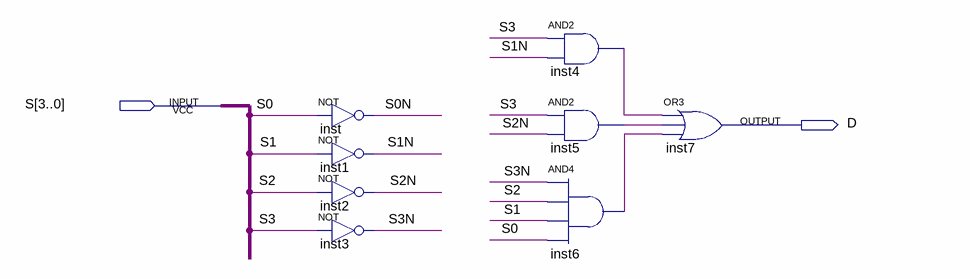
[diagram p0: schematic sheet]
// Quartus schematic D3.bdf as structural Verilog: 8 symbols, 2 pins
module D3 (
  input  [3:0] S,
  output D
);

  wire inst4_out, inst5_out, inst6_out, S0N, S1N, S2N, S3N;

  not inst (S0N, S[0]);
  not inst1 (S1N, S[1]);
  not inst2 (S2N, S[2]);
  not inst3 (S3N, S[3]);
  and inst4 (inst4_out, S[3], S1N);
  and inst5 (inst5_out, S[3], S2N);
  and inst6 (inst6_out, S3N, S[2], S[1], S[0]);
  or inst7 (D, inst4_out, inst5_out, inst6_out);
endmodule
